# Altium project PCB.PrjPcb
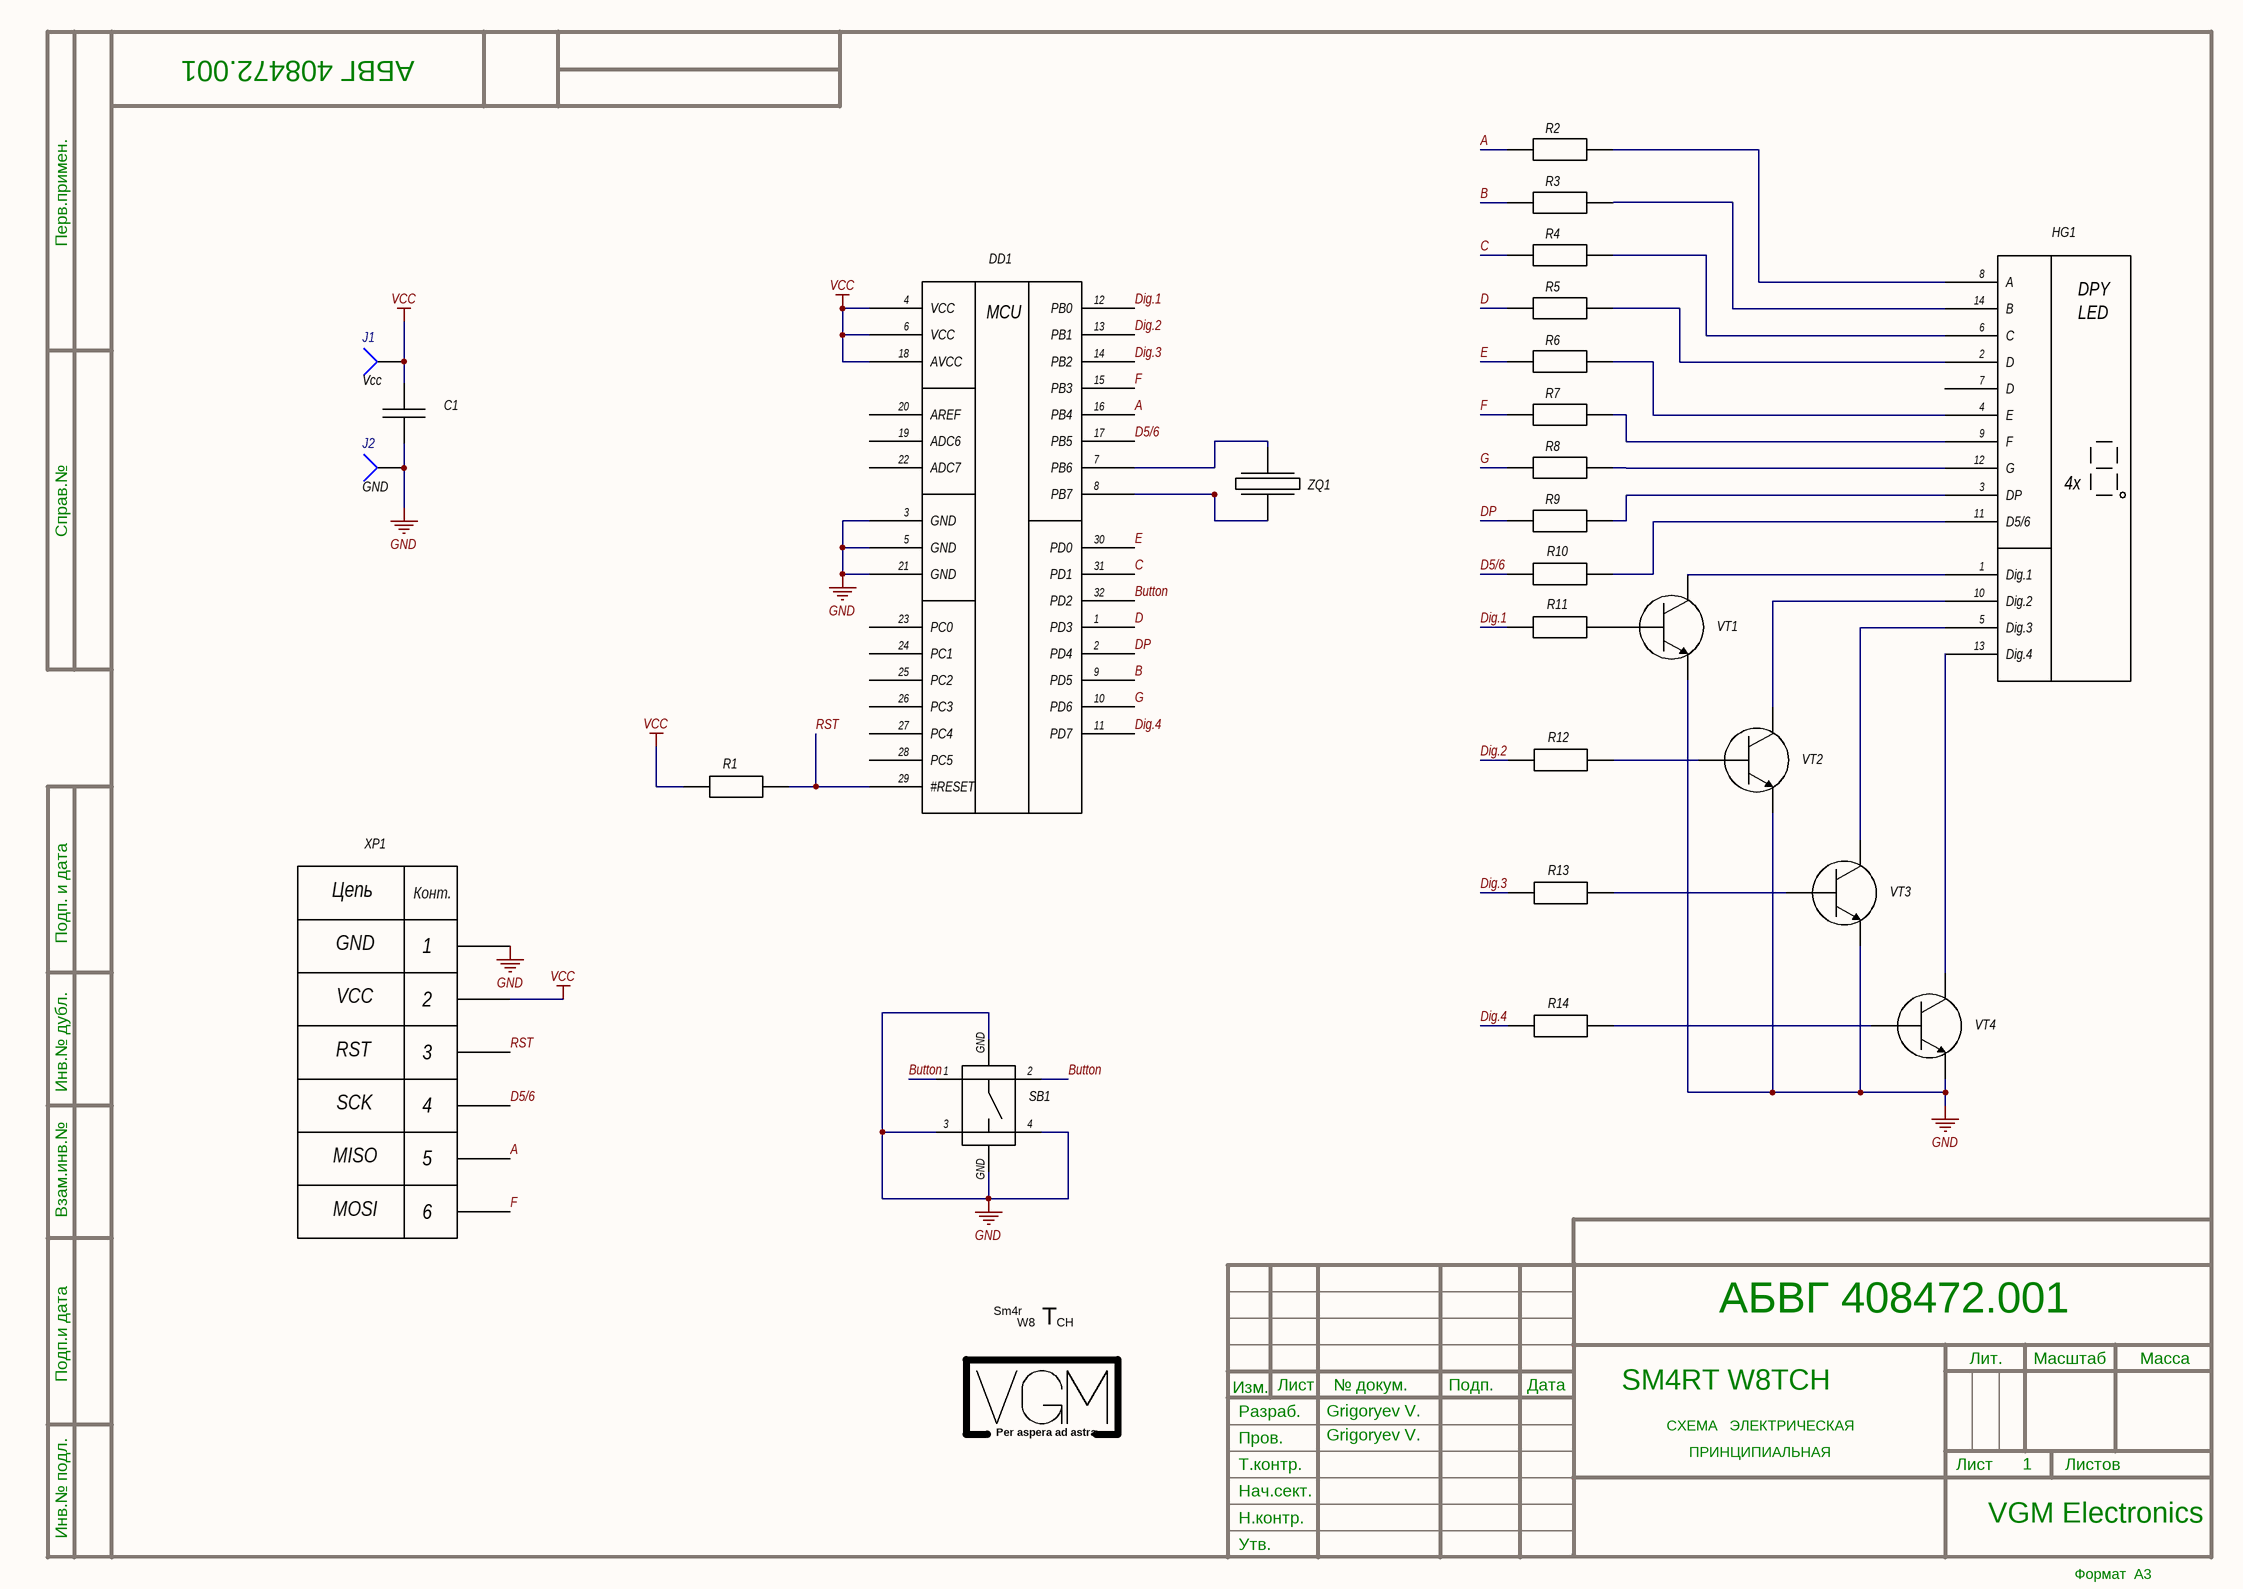
[diagram p0: Schematic.SchDoc]
1 sheet, 28 parts. Net scope: global (net labels, ports and power ports of the same name join across sheets).
Board file: PCB_oshpark.PcbDoc

## Sheet Schematic.SchDoc: Sm4rt W8tch
size 420 x 297 mm; CheckedBy: Grigoryev V.; Author: Grigoryev V.; CompanyName: VGM Electronics; Organization: VGM Electronics; Revision: 1.0; SheetNumber: 1; SheetTotal: 1; PageSetup: Record=PageOptions|CenterHorizontal=True|CenterVertical=True|PrintScale=0.94|XCorrection=1.00|YCorrection=1.00|PrintKind=1|BorderSize=5000000|LeftOffset=0|BottomOffset=0|Orientation=1|PaperLength=1000|PaperWidth=1000|Scale=100|PaperSource=7|PrintQuality=-4|MediaType=1|DitherType=10|PaperKind=A4|PrintScaleMode=1; DecimalNumber: АБВГ 408472.001; Name: SM4RT W8TCH

### Parts
C1  Ceramic Cap  [MLCC 0603 (1608)]  (value not drawn)
DD1  ATmega48  [TQFP-32]  (value not drawn)
HG1  GNQ-2841Cx/Dx  [GNQ-2841Cx/Dx]  (value not drawn)
J1  Vcc  [PIN1]
J2  GND  [PIN1]
R1  Resistor  [Resistor 0603 (1208)]  (value not drawn)
R2  Resistor  [Resistor 0603 (1208)]  (value not drawn)
R3  Resistor  [Resistor 0603 (1208)]  (value not drawn)
R4  Resistor  [Resistor 0603 (1208)]  (value not drawn)
R5  Resistor  [Resistor 0603 (1208)]  (value not drawn)
R6  Resistor  [Resistor 0603 (1208)]  (value not drawn)
R7  Resistor  [Resistor 0603 (1208)]  (value not drawn)
R8  Resistor  [Resistor 0603 (1208)]  (value not drawn)
R9  Resistor  [Resistor 0603 (1208)]  (value not drawn)
R10  Resistor  [Resistor 0603 (1208)]  (value not drawn)
R11  Resistor  [Resistor 0603 (1208)]  (value not drawn)
R12  Resistor  [Resistor 0603 (1208)]  (value not drawn)
R13  Resistor  [Resistor 0603 (1208)]  (value not drawn)
R14  Resistor  [Resistor 0603 (1208)]  (value not drawn)
SB1  IT-1189UE  [IT-1189UE]  (value not drawn)
SM4RT_W8TCH  SM4RT W8TCH  [Sm4rt W8tch]  (value not drawn)
VGM_LOGO  VGM Electronics Logo  [LOGO medium]  (value not drawn)
VT1  BC817-40  [SOT-23]  (value not drawn)
VT2  BC817-40  [SOT-23]  (value not drawn)
VT3  BC817-40  [SOT-23]  (value not drawn)
VT4  BC817-40  [SOT-23]  (value not drawn)
XP1  AVR Programming Pad  [AVR Programming Pad]  (value not drawn)
ZQ1  XTAL  [XTAL 32.768 kHz 0603]  (value not drawn)

### Nets
GND: C1.1 DD1.3(GND) DD1.5(GND) DD1.21(GND) J2.1 SB1.3 SB1.4 SB1.GND VT1.2(E) VT2.2(E) VT3.2(E) VT4.2(E) XP1.1
VCC: C1.2 DD1.4(VCC) DD1.6(VCC) DD1.18(AVCC) J1.1 R1.2 XP1.2
A: DD1.16(PB4) R2.1 XP1.5
B: DD1.9(PD5) R3.1
Button: DD1.32(PD2) SB1.1 SB1.2
C: DD1.31(PD1) R4.1
D: DD1.1(PD3) R5.1
D5/6: DD1.17(PB5) R10.1 XP1.4
Dig.1: DD1.12(PB0) R11.1
Dig.2: DD1.13(PB1) R12.1
Dig.3: DD1.14(PB2) R13.1
Dig.4: DD1.11(PD7) R14.1
DP: DD1.2(PD4) R9.1
E: DD1.30(PD0) R6.1
F: DD1.15(PB3) R7.1 XP1.6
G: DD1.10(PD6) R8.1
RST: DD1.29(#RESET) R1.1 XP1.3
NetDD1_7: DD1.7(PB6) ZQ1.2
NetDD1_8: DD1.8(PB7) ZQ1.1
NetHG1_1: HG1.1(Dig.1) VT1.3(C)
NetHG1_2: HG1.2(D) R5.2
NetHG1_3: HG1.3(DP) R9.2
NetHG1_4: HG1.4(E) R6.2
NetHG1_5: HG1.5(Dig.3) VT3.3(C)
NetHG1_6: HG1.6(C) R4.2
NetHG1_8: HG1.8(A) R2.2
NetHG1_9: HG1.9(F) R7.2
NetHG1_10: HG1.10(Dig.2) VT2.3(C)
NetHG1_11: HG1.11(D5/6) R10.2
NetHG1_12: HG1.12(G) R8.2
NetHG1_13: HG1.13(Dig.4) VT4.3(C)
NetHG1_14: HG1.14(B) R3.2
NetR11_2: R11.2 VT1.1(B)
NetR12_2: R12.2 VT2.1(B)
NetR13_2: R13.2 VT3.1(B)
NetR14_2: R14.2 VT4.1(B)

Not connected (* = marked no-connect by the designer): DD1 19(ADC6) 20(AREF) 22(ADC7) 23(PC0) 24(PC1) 25(PC2) 26(PC3) 27(PC4) 28(PC5); HG1 7(D)

### Notes on the sheet
- Перв.примен.
- Справ.№
- Подп. и дата
- Инв.№ дубл.
- Взам.инв.№
- Подп.и дата
- Разраб.
- Изм.
- Лист
- № докум.
- Подп.
- Дата
- Лит.
- Масштаб
- Масса
- Т.контр.
- Пров.
- СХЕМА   ЭЛЕКТРИЧЕСКАЯ
- ПРИНЦИПИАЛЬНАЯ
- Листов
- Инв.№ подл.
- Утв.
- Н.контр.
- Нач.сект.
- Формат  A3
- (in symbol ATmega48) MCU
- (in symbol AVR Programming Pad) Цепь; Конт.; GND; VCC; RST; SCK; MISO; MOSI
- (in symbol GNQ-2841Cx/Dx) DPY; LED; 4x
- (in symbol SM4RT W8TCH) Sm4r; W8; CH; T
- (in symbol VGM LOGO) Per aspera ad astra

### Library data of the parts
DD1 = ATmega48: 8-bit AVR MCU; LatestRevisionDate: 26-Jun-2015; LatestRevisionNote: Release; Publisher: Victor Grigoryev; PackageDescription: TQFP-32, 32 Leads; Datasheet: http://www.atmel.com/images/doc2545.pdf
HG1 = GNQ-2841Cx/Dx: Green 7-segment display x 4; LatestRevisionDate: 26-Jun-2015; LatestRevisionNote: Release; Publisher: Victor Grigoryev; PackageDescription: DIP-14-900, 14 pin; Datasheet: http://www.g-nor.com/html/GNQ-2841Cx-Dx.pdf
J1 J2 = Socket: LatestRevisionDate: 17-Jul-2002; LatestRevisionNote: Re-released for DXP Platform.; Publisher: Altium Limited
SB1 = IT-1189UE: SMD Tact Switch; LatestRevisionDate: 27-Jun-2015; LatestRevisionNote: Release; Publisher: Victor Grigoryev; PackageDescription: Custom; 4 SMD pads; Datasheet: http://img.smparts.com/draw/switronic/switches_switronic/buttons_tact_it1189e_b.gif
SM4RT_W8TCH = SM4RT W8TCH: SM4RT W8TCH Logo; Datasheet: https://github.com/VGM-Electronics/Sm4rt-W8tch/; Publisher: Victor Grigoryev; PackageDescription: May vary; LatestRevisionNote: Release; latestRevisionDate: 24-Oct-2015
VGM_LOGO = VGM LOGO: Datasheet: http://vk.com/victor_grigoryev/; Publisher: Victor Grigoryev; PackageDescription: May vary; LatestRevisionNote: Release; LatestRevisionDate: 24-Oct-2015
VT1-VT4 = BC817-40: NPN General Purpose Transistor; LatestRevisionDate: 26-Jun-2015; LatestRevisionNote: Release; Publisher: Victor Grigoryev; PackageDescription: SOT-23, 3 pin; Datasheet: http://www.nxp.com/documents/data_sheet/BC817_BC817W_BC337.pdf
XP1 = AVR Programming Pad: Group of pads for programming AVR MCU; LatestRevisionDate: 07-Aug-2015; LatestRevisionNote: Release; Publisher: Victor Grigoryev; PackageDescription: 6 SMD pads; Datasheet: N/A
ZQ1 = XTAL: Quartz Oscillator; LatestRevisionDate: 26-Jun-2015; LatestRevisionNote: Release; Publisher: Victor Grigoryev; PackageDescription: May vary, 2 pin; Datasheet: N/A
C1 = Ceramic Cap: LatestRevisionDate: 25-Mar-2015; LatestRevisionNote: Release; Publisher: Victor Grigoryev; PackageDescription: Ceramic Cap; SMD 2 pin; Datasheet: http://www.mouser.com/ds/2/212/KEM_C1002_X7R_SMD-357932.pdf
R1-R14 = Resistor: Datasheet: N/A; LatestRevisionDate: 12-Oct-2015; LatestRevisionNote: Release; Publisher: Victor Grigoryev; PackageDescription: May vary, 2 pin